# EAGLE design main_backupboard (EAGLE 9.6.2)

## Sheet 1 of 2
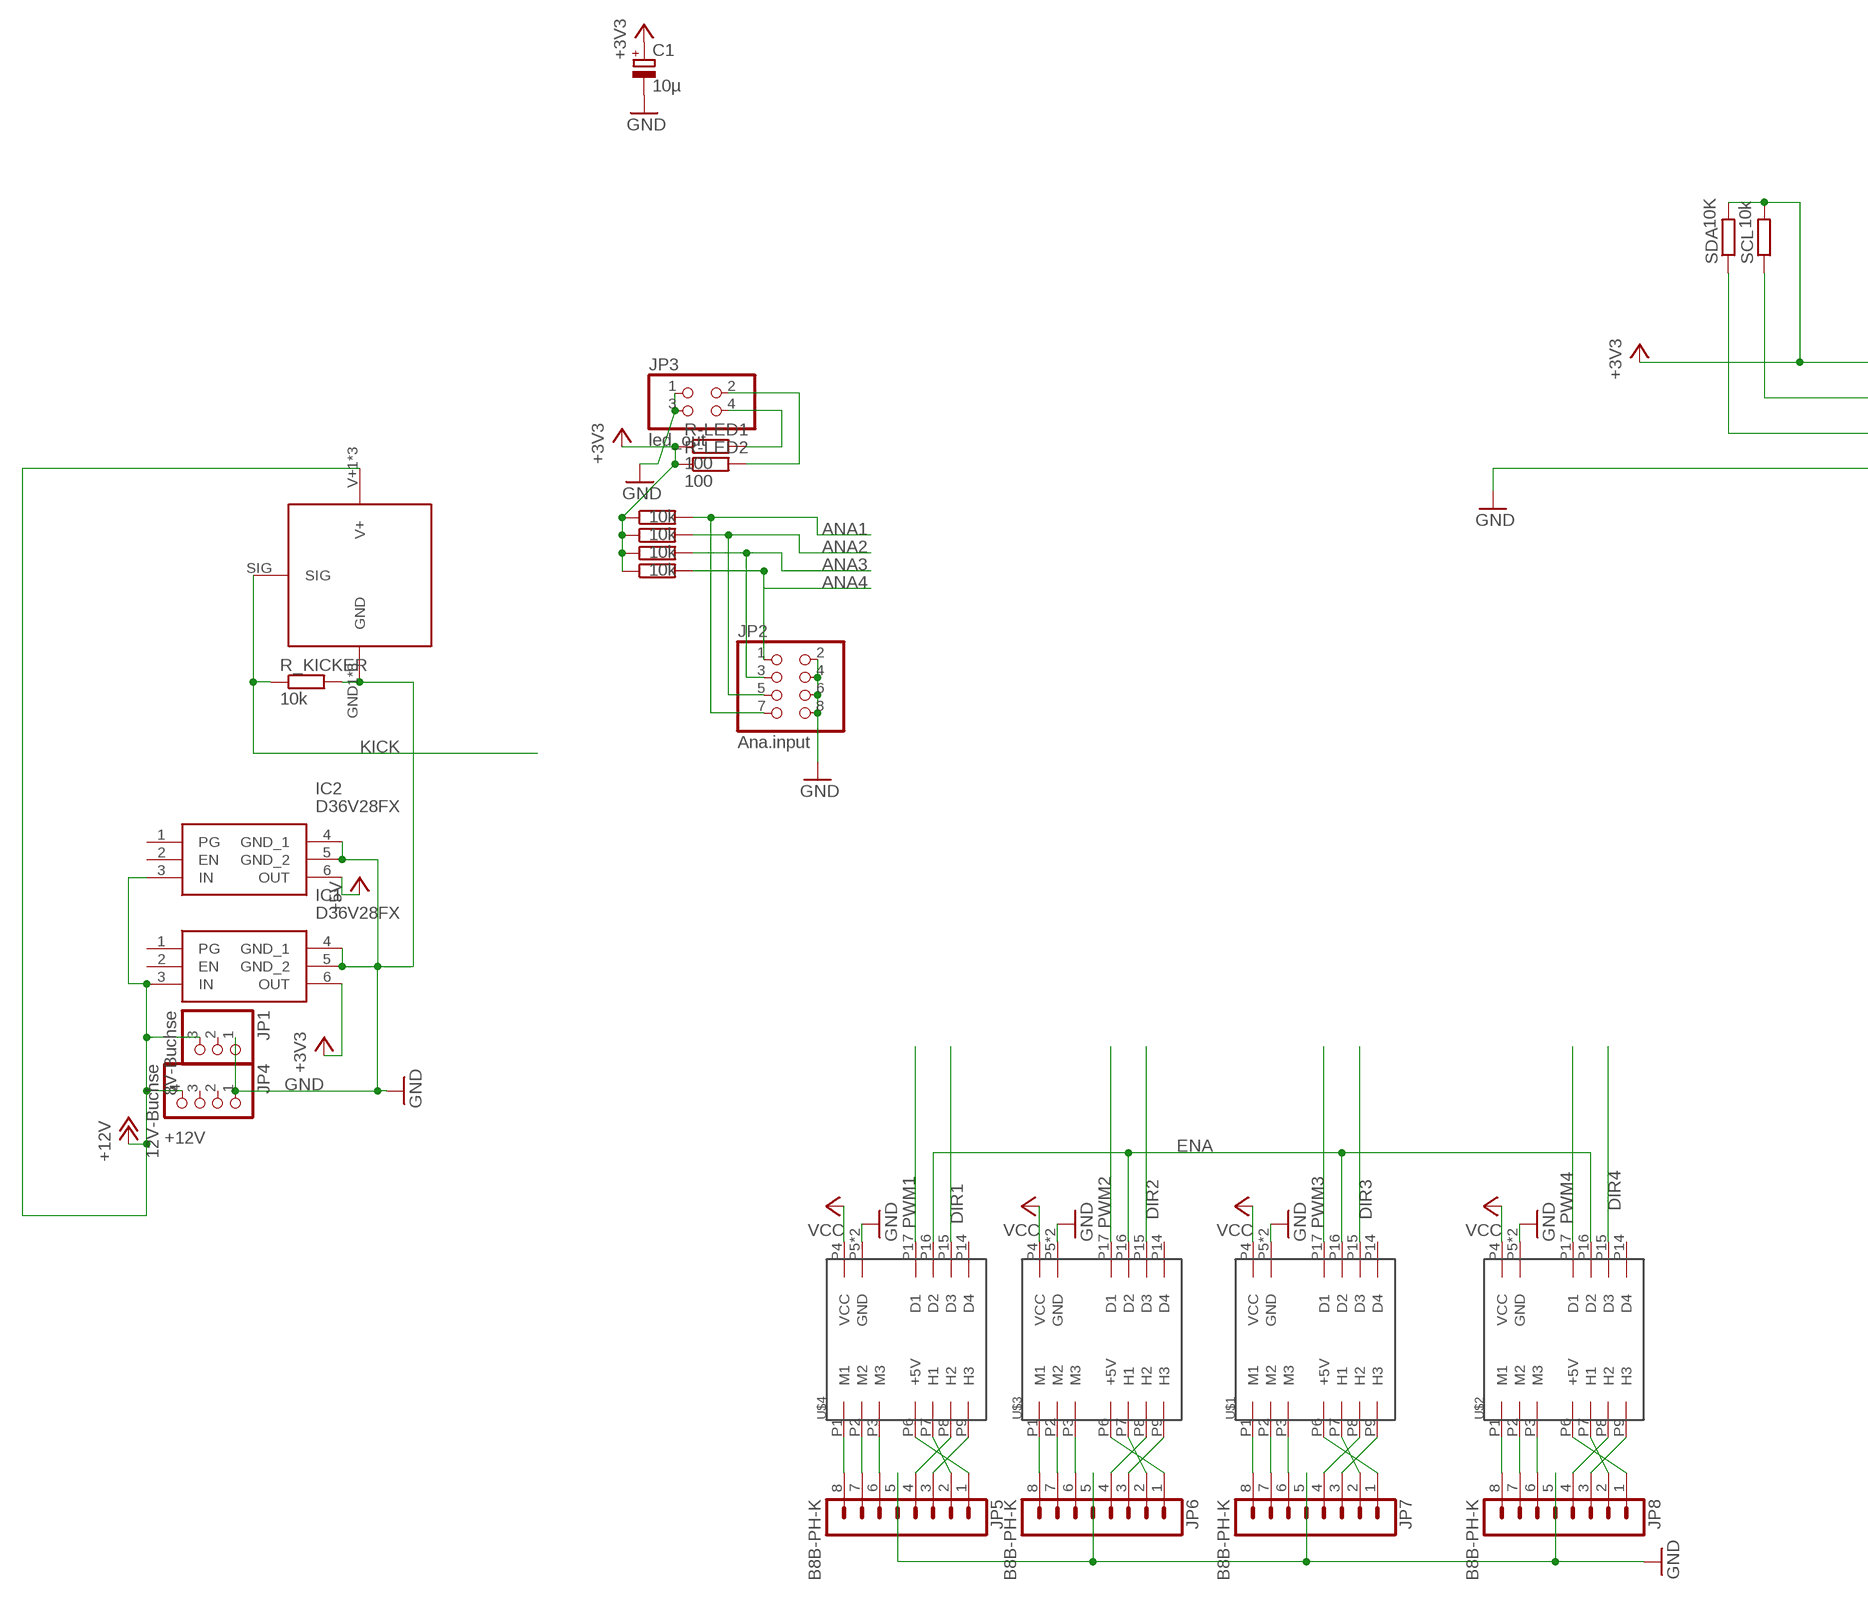
[diagram p0: schematic, sheet 1, part 1 of 2]
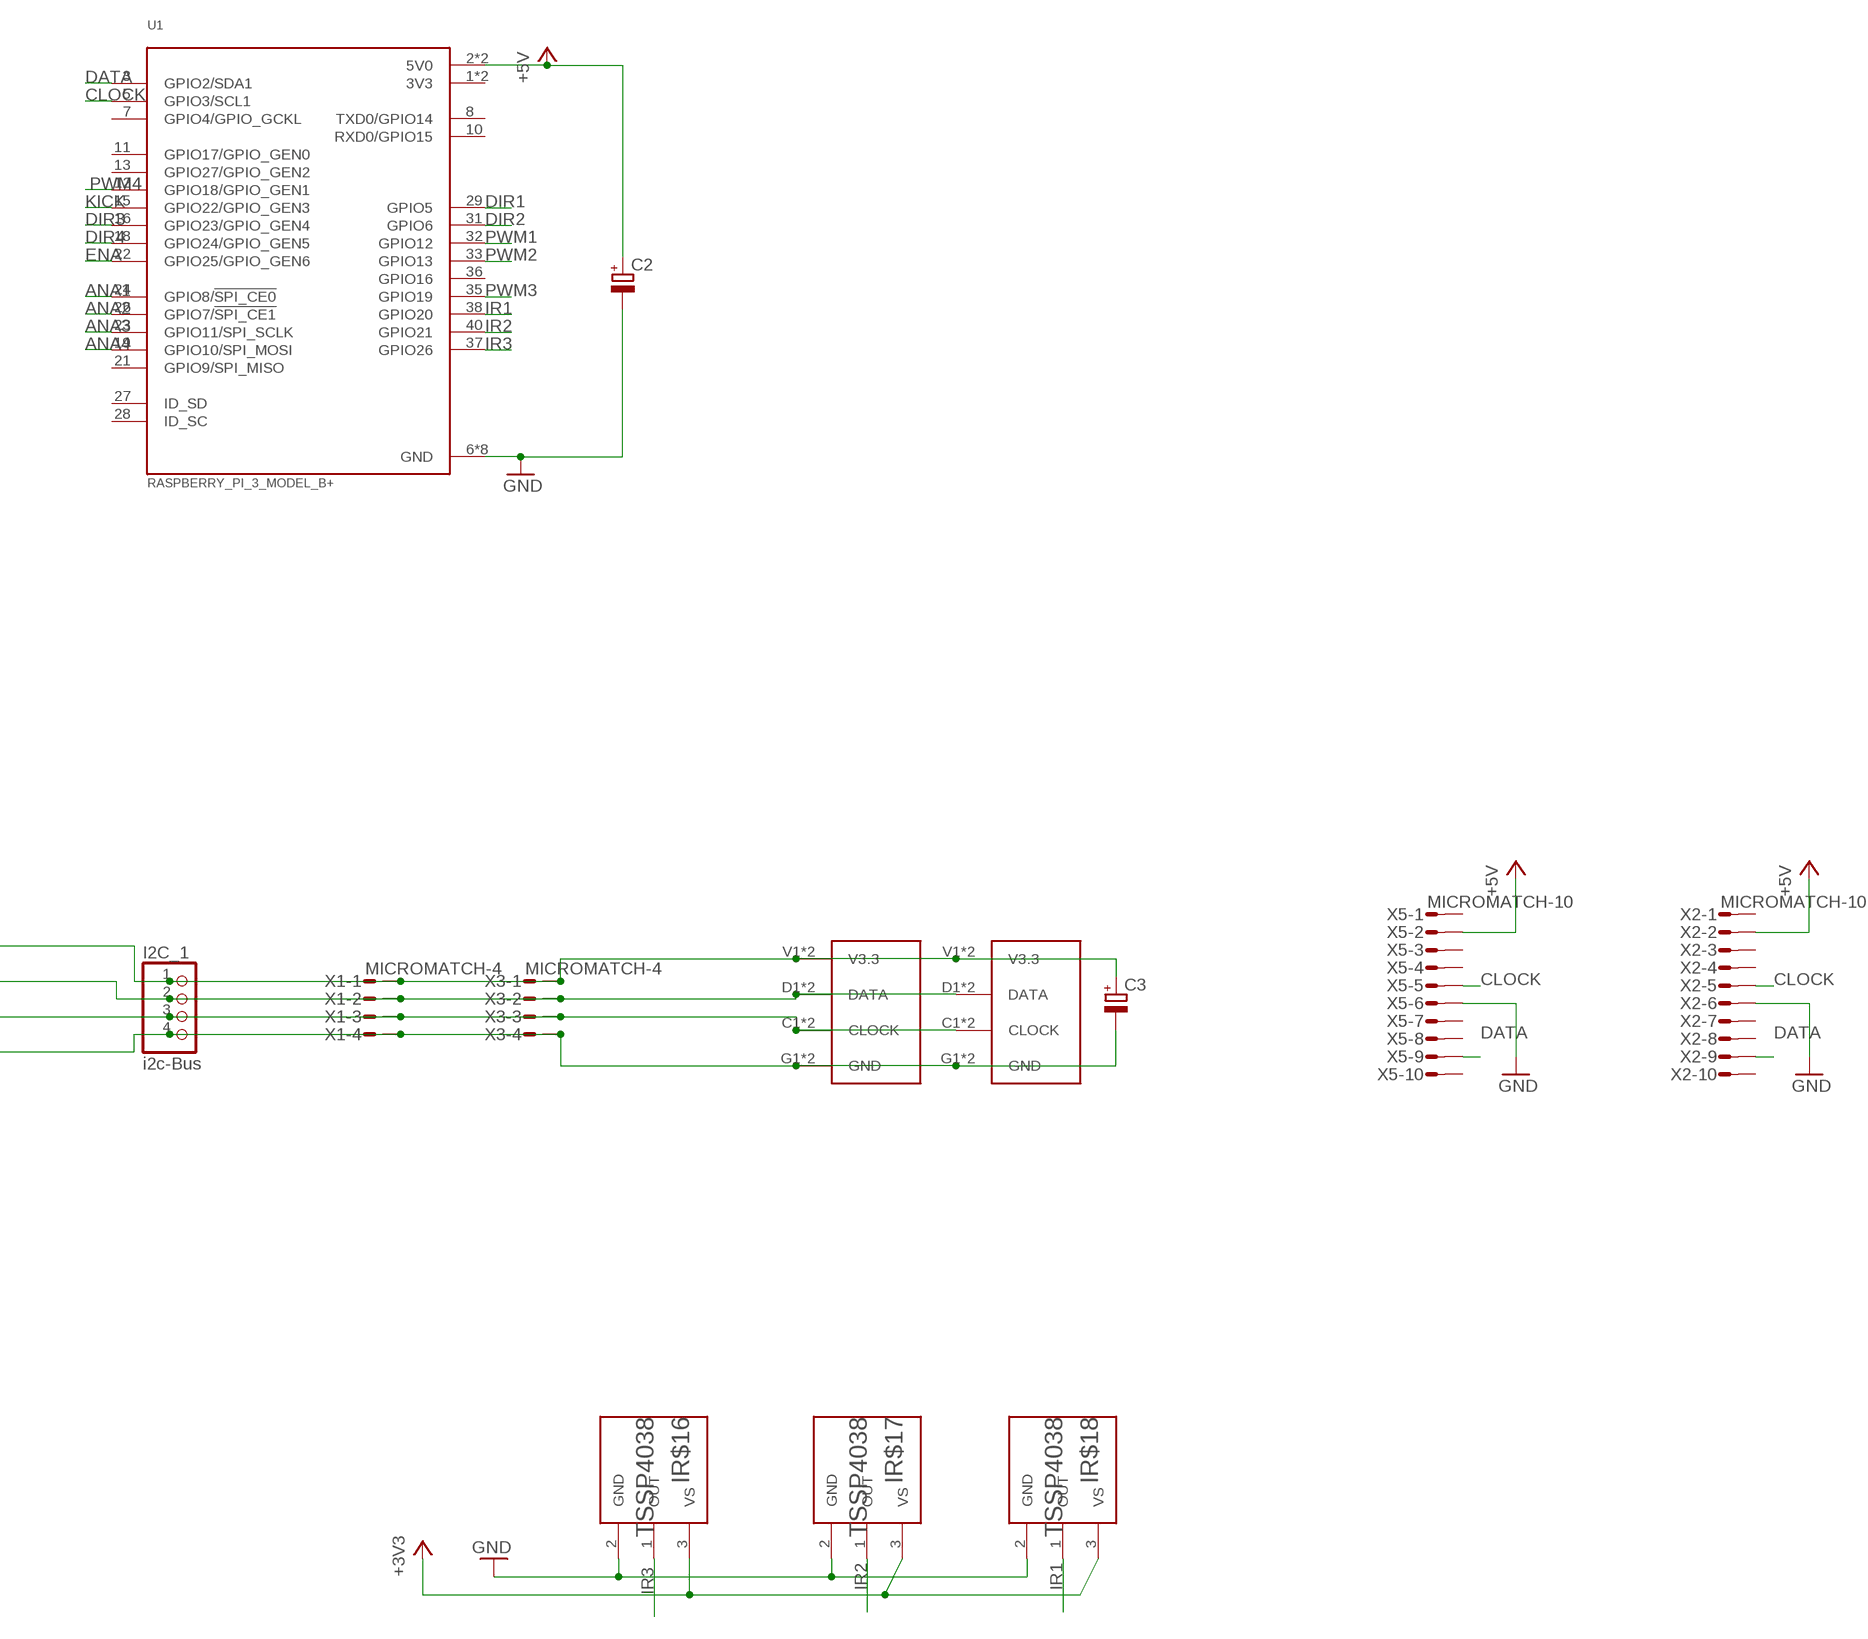
[diagram p1: schematic, sheet 1, part 2 of 2]

### Parts
C1  10µ  CPOL-EUE2,5-6E  [E2,5-6E]
C2  CPOL-EUE2-5  [E2-5]
C3  CPOL-EUE2-5  [E2-5]
I2C_1  i2c-Bus  PINHD-1X4  [1X04]
IC1  D36V28FX  [D36V28FX]
IC2  D36V28FX  [D36V28FX]
IR$16  TSSP4038  [XDCR_TSSP4038]
IR$17  TSSP4038  [XDCR_TSSP4038]
IR$18  TSSP4038  [XDCR_TSSP4038]
JP1  8V-Buchse  PINHD-1X3  [1X03]
JP2  Ana.input  PINHD-2X4  [2X04]
JP3  led_out  PINHD-2X2  [2X02]
JP4  12V-Buchse  PINHD-1X4  [1X04]
JP5  B8B-PH-K  [B8B-PH-K]
JP6  B8B-PH-K  [B8B-PH-K]
JP7  B8B-PH-K  [B8B-PH-K]
JP8  B8B-PH-K  [B8B-PH-K]
R-LED1  100  R-EU_0207/10  [0207/10]
R-LED2  100  R-EU_0207/10  [0207/10]
R_AD14  10k  R-EU_0207/10  [0207/10]
R_AD25  10k  R-EU_0207/10  [0207/10]
R_AD26  10k  R-EU_0207/10  [0207/10]
R_AD27  10k  R-EU_0207/10  [0207/10]
R_KICKER  10k  R-EU_0207/10  [0207/10]
SCL  10k  R-EU_0207/10  [0207/10]
SDA  10K  R-EU_0207/10  [0207/10]
U1  RASPBERRY_PI_3_MODEL_B+  [MODULE_RASPBERRY_PI_3_MODEL_B+]
U$1  24/2  [24/2]
U$2  24/2  [24/2]
U$3  24/2  [24/2]
U$4  24/2  [24/2]
U$8  TASTER_LED  [TASTER_LED]
U$9  TASTER_LED  [TASTER_LED]
U$17  KICKER  [KICKER]
X1  MICROMATCH-4  [MICROMATCH-4]
X2  MICROMATCH-10  [MICROMATCH-10]
X3  MICROMATCH-4  [MICROMATCH-4]
X5  MICROMATCH-10  [MICROMATCH-10]

### Nets
+3V3: C1.+ C3.+ I2C_1.1 IC1.6(OUT) IR$16.3(VS) IR$17.3(VS) IR$18.3(VS) R-LED1.1 R-LED2.1 R_AD14.1 R_AD25.1 R_AD26.1 R_AD27.1 SCL.2 SDA.2 U$8.V1(V3.3) U$8.V2(V3.3) U$9.V1(V3.3) U$9.V2(V3.3) X1.1 X3.1
+5V: C2.+ IC2.6(OUT) U1.2(5V0) U1.4(5V0) X2.2 X5.2
+12V: IC1.3(IN) IC2.3(IN) JP1.3 JP4.4 U$1.P4(VCC) U$2.P4(VCC) U$3.P4(VCC) U$4.P4(VCC) U$17.V+1(V+) U$17.V+2(V+) U$17.V+3(V+) ; supply symbol labelled VCC
ANA1: JP2.7 R_AD25.2 U1.24(GPIO8/!SPI_CE0!)
ANA2: JP2.5 R_AD26.2 U1.26(GPIO7/!SPI_CE1!)
ANA3: JP2.3 R_AD27.2 U1.23(GPIO11/SPI_SCLK)
ANA4: JP2.1 R_AD14.2 U1.19(GPIO10/SPI_MOSI)
CLOCK: I2C_1.3 SDA.1 U1.5(GPIO3/SCL1) U$8.C1(CLOCK) U$8.C2(CLOCK) U$9.C1(CLOCK) U$9.C2(CLOCK) X1.3 X2.5 X3.3 X5.5
DATA: I2C_1.2 SCL.1 U1.3(GPIO2/SDA1) U$8.D1(DATA) U$8.D2(DATA) U$9.D1(DATA) U$9.D2(DATA) X1.2 X2.9 X3.2 X5.9
DIR1: U1.29(GPIO5) U$4.P15(D3)
DIR2: U1.31(GPIO6) U$3.P15(D3)
DIR3: U1.16(GPIO23/GPIO_GEN4) U$1.P15(D3)
DIR4: U1.18(GPIO24/GPIO_GEN5) U$2.P15(D3)
ENA: U1.22(GPIO25/GPIO_GEN6) U$1.P16(D2) U$2.P16(D2) U$3.P16(D2) U$4.P16(D2)
GND: C1.- C2.- C3.- I2C_1.4 IC1.4(GND_1) IC1.5(GND_2) IC2.4(GND_1) IC2.5(GND_2) IR$16.2(GND) IR$17.2(GND) IR$18.2(GND) JP1.1 JP2.2 JP2.4 JP2.6 JP2.8 JP3.1 JP3.3 JP4.1 JP5.5 JP6.5 JP7.5 JP8.5 R_KICKER.2 U1.6(GND) U1.9(GND) U1.14(GND) U1.20(GND) U1.25(GND) U1.30(GND) U1.34(GND) U1.39(GND) U$1.P5(GND) U$1.P18(GND) U$2.P5(GND) U$2.P18(GND) U$3.P5(GND) U$3.P18(GND) U$4.P5(GND) U$4.P18(GND) U$8.G1(GND) U$8.G2(GND) U$9.G1(GND) U$9.G2(GND) U$17.GND1(GND) U$17.GND2(GND) U$17.GND3(GND) U$17.GND4(GND) U$17.GND5(GND) U$17.GND6(GND) U$17.GND7(GND) U$17.GND8(GND) X1.4 X2.6 X3.4 X5.6
IR1: IR$18.1(OUT) U1.38(GPIO20)
IR2: IR$17.1(OUT) U1.40(GPIO21)
IR3: IR$16.1(OUT) U1.37(GPIO26)
KICK: R_KICKER.1 U1.15(GPIO22/GPIO_GEN3) U$17.SIG
N$6: JP5.8 U$4.P1(M1)
N$7: JP5.7 U$4.P2(M2)
N$8: JP3.4 R-LED1.2
N$9: JP3.2 R-LED2.2
N$10: JP5.6 U$4.P3(M3)
N$11: JP6.8 U$3.P1(M1)
N$12: JP6.7 U$3.P2(M2)
N$13: JP6.6 U$3.P3(M3)
N$14: JP7.8 U$1.P1(M1)
N$15: JP7.7 U$1.P2(M2)
N$16: JP7.6 U$1.P3(M3)
N$17: JP8.8 U$2.P1(M1)
N$18: JP8.7 U$2.P2(M2)
N$19: JP8.6 U$2.P3(M3)
N$20: JP5.1 U$4.P6(+5V)
N$21: JP6.1 U$3.P6(+5V)
N$22: JP7.1 U$1.P6(+5V)
N$23: JP8.1 U$2.P6(+5V)
N$24: JP5.2 U$4.P7(H1)
N$25: JP5.3 U$4.P9(H3)
N$26: JP5.4 U$4.P8(H2)
N$27: JP6.2 U$3.P7(H1)
N$28: JP6.3 U$3.P9(H3)
N$29: JP6.4 U$3.P8(H2)
N$30: JP7.2 U$1.P7(H1)
N$31: JP7.3 U$1.P9(H3)
N$32: JP7.4 U$1.P8(H2)
N$33: JP8.2 U$2.P7(H1)
N$34: JP8.3 U$2.P9(H3)
N$35: JP8.4 U$2.P8(H2)
PWM1: U1.32(GPIO12) U$4.P17(D1)
PWM2: U1.33(GPIO13) U$3.P17(D1)
PWM3: U1.35(GPIO19) U$1.P17(D1)
PWM4: U1.12(GPIO18/GPIO_GEN1) U$2.P17(D1)
Unconnected: IC1.1(PG) IC1.2(EN) IC2.1(PG) IC2.2(EN) JP1.2 JP4.2 JP4.3 U1.7(GPIO4/GPIO_GCKL) U1.8(TXD0/GPIO14) U1.10(RXD0/GPIO15) U1.11(GPIO17/GPIO_GEN0) U1.13(GPIO27/GPIO_GEN2) U1.21(GPIO9/SPI_MISO) U1.27(ID_SD) U1.28(ID_SC) U1.36(GPIO16) U$1.P14(D4) U$2.P14(D4) U$3.P14(D4) U$4.P14(D4) X2.1 X2.3 X2.4 X2.7 X2.8 X2.10 X5.1 X5.3 X5.4 X5.7 X5.8 X5.10

## Sheet 2 of 2

## Power pins joined to a net without a drawn wire
3V3: U1.1(3V3) U1.17(3V3)

## Library data of the parts
C1-C3 = rcl:CPOL-EU: POLARIZED CAPACITOR, European symbol; SPICEPREFIX: C
I2C_1 JP4 = pinhead:PINHD-1X4: PIN HEADER
IC1 IC2 = D36V28FX:D36V28FX: 5V, 3.2A Step-Down Voltage Regulator D36V28F5 Source: Datasheet <https://www.pololu.com/product/3782>; DESCRIPTION: 5V, 3.2A Step-Down Voltage Regulator D36V28F5; HEIGHT: 8.77mm; MANUFACTURER_NAME: POLOLU ROBOTICS & ELECTRONICS; MANUFACTURER_PART_NUMBER: D36V28FX
IR$16-IR$18 = TSSP4038:TSSP4038: Check availability <https://pricing.snapeda.com/parts/TSSP4038/Vishay%20Semiconductor/view-part?ref=eda>; AVAILABILITY: In Stock; DESCRIPTION: Remote Receiver Sensor, 38.0kHz 1m PCB, Through Hole; MF: Vishay Semiconductor; MP: TSSP4038; PACKAGE: None; PRICE: None; PURCHASE-URL: https://pricing.snapeda.com/search/part/TSSP4038/?ref=eda
JP1 = pinhead:PINHD-1X3: PIN HEADER
JP2 = pinhead:PINHD-2X4: PIN HEADER
JP3 = pinhead:PINHD-2X2: PIN HEADER
JP5-JP8 = con-jst-ph:B8B-PH-K: HEADER
R-LED1 R-LED2 R_AD14 R_AD25-R_AD27 R_KICKER SCL SDA = rcl:R-EU_: RESISTOR, European symbol; SPICEPREFIX: R
U1 = RASPBERRY_PI_3_MODEL_B_:RASPBERRY_PI_3_MODEL_B+: BCM2835 Raspberry Pi Model B+ - ARM11, VideoCore MPU Embedded Evaluation Board Check availability <https://pricing.snapeda.com/parts/RASPBERRY%20PI%203%20MODEL%20B%2B/Raspberry%20Pi/view-part?ref=eda>; AVAILABILITY: In Stock; DESCRIPTION: RASPBERRY PI 3 MOD B+ BCM2837B0; MF: Raspberry Pi; MP: RASPBERRY PI 3 MODEL B+; PACKAGE: None; PRICE: None; PURCHASE-URL: https://pricing.snapeda.com/search/part/RASPBERRY PI 3 MODEL B+/?ref=eda
U$1-U$4 = maxon-Regler:24/2
U$8 U$9 = Taster_LED:TASTER_LED: Taster / LED Board mit 2 Tastern und 2 LEDs Angeschlossen über i2c Port Expander PCF8574TS i2c Adresse zwingend per Lötbrücke zu setzen.
U$17 = kicker:KICKER
X1 X3 = con-amp-micromatch:MICROMATCH-4: MicroMaTch 4 7-215464-4 / 0-215464-4 Drawing Number C-215464 DDEController.pdf; MPN: 7-215464-4; OC_FARNELL: 3784629; OC_NEWARK: 19R8124
X2 X5 = con-amp-micromatch:MICROMATCH-10: MicroMaTch 10 8-215464-0 / 1-215464-0 Drawing Number C-215464 DDEController.pdf; MF: FARNELL; MPN: 8-215464-0; OC_FARNELL: 3784654; OC_NEWARK: 19J6430

## Board
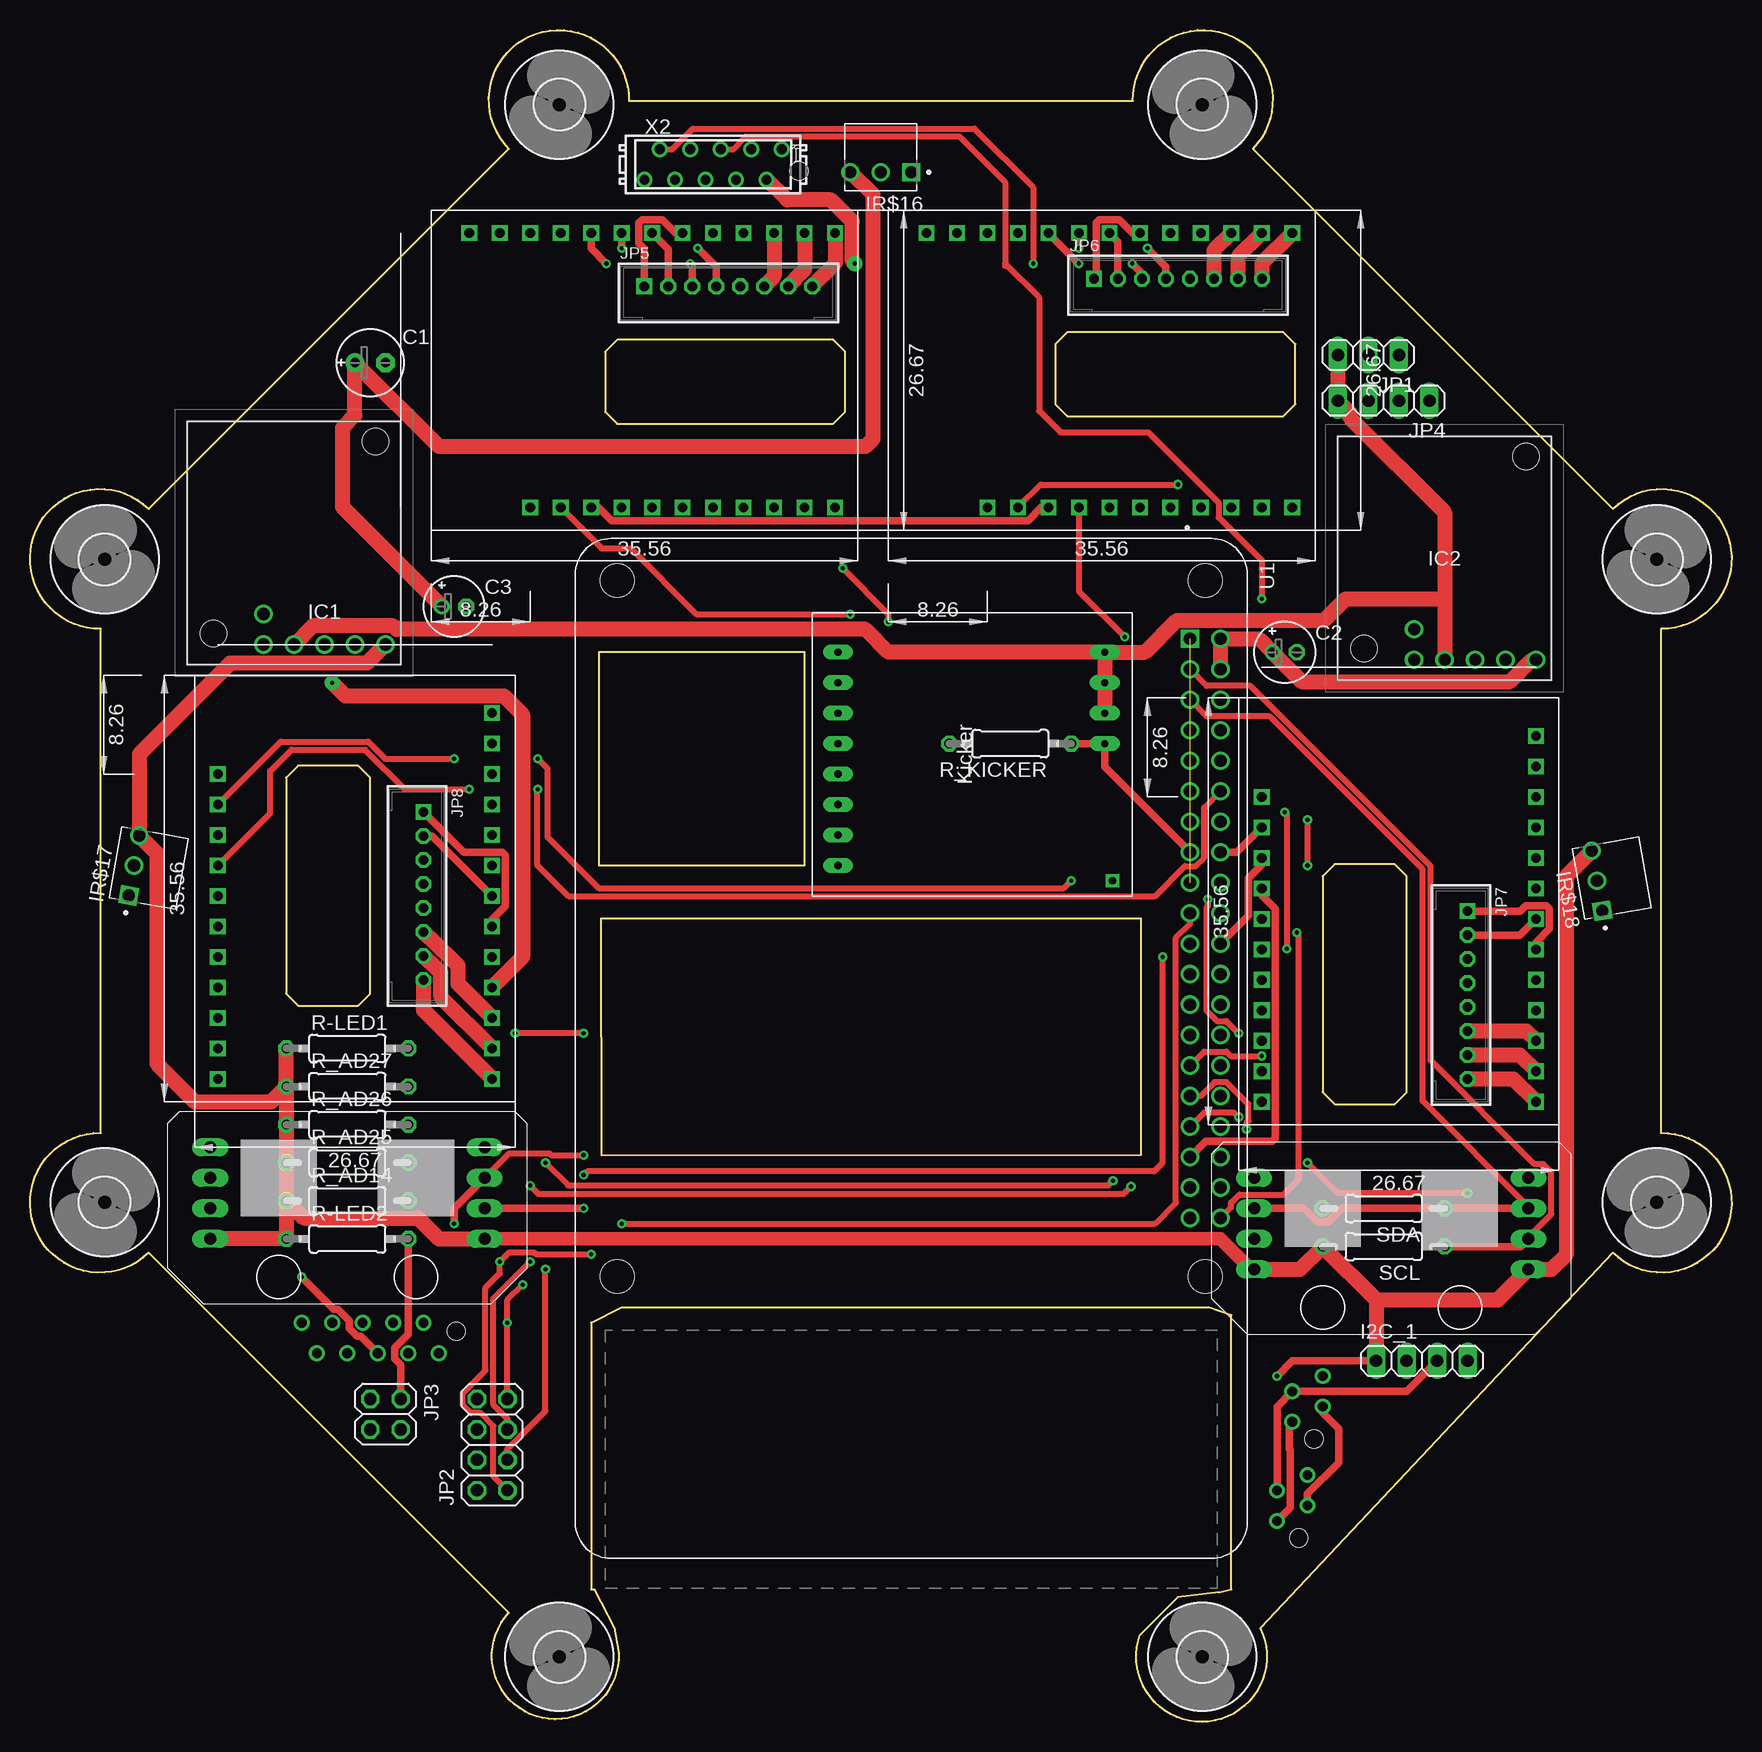
[diagram p2: board, top side]
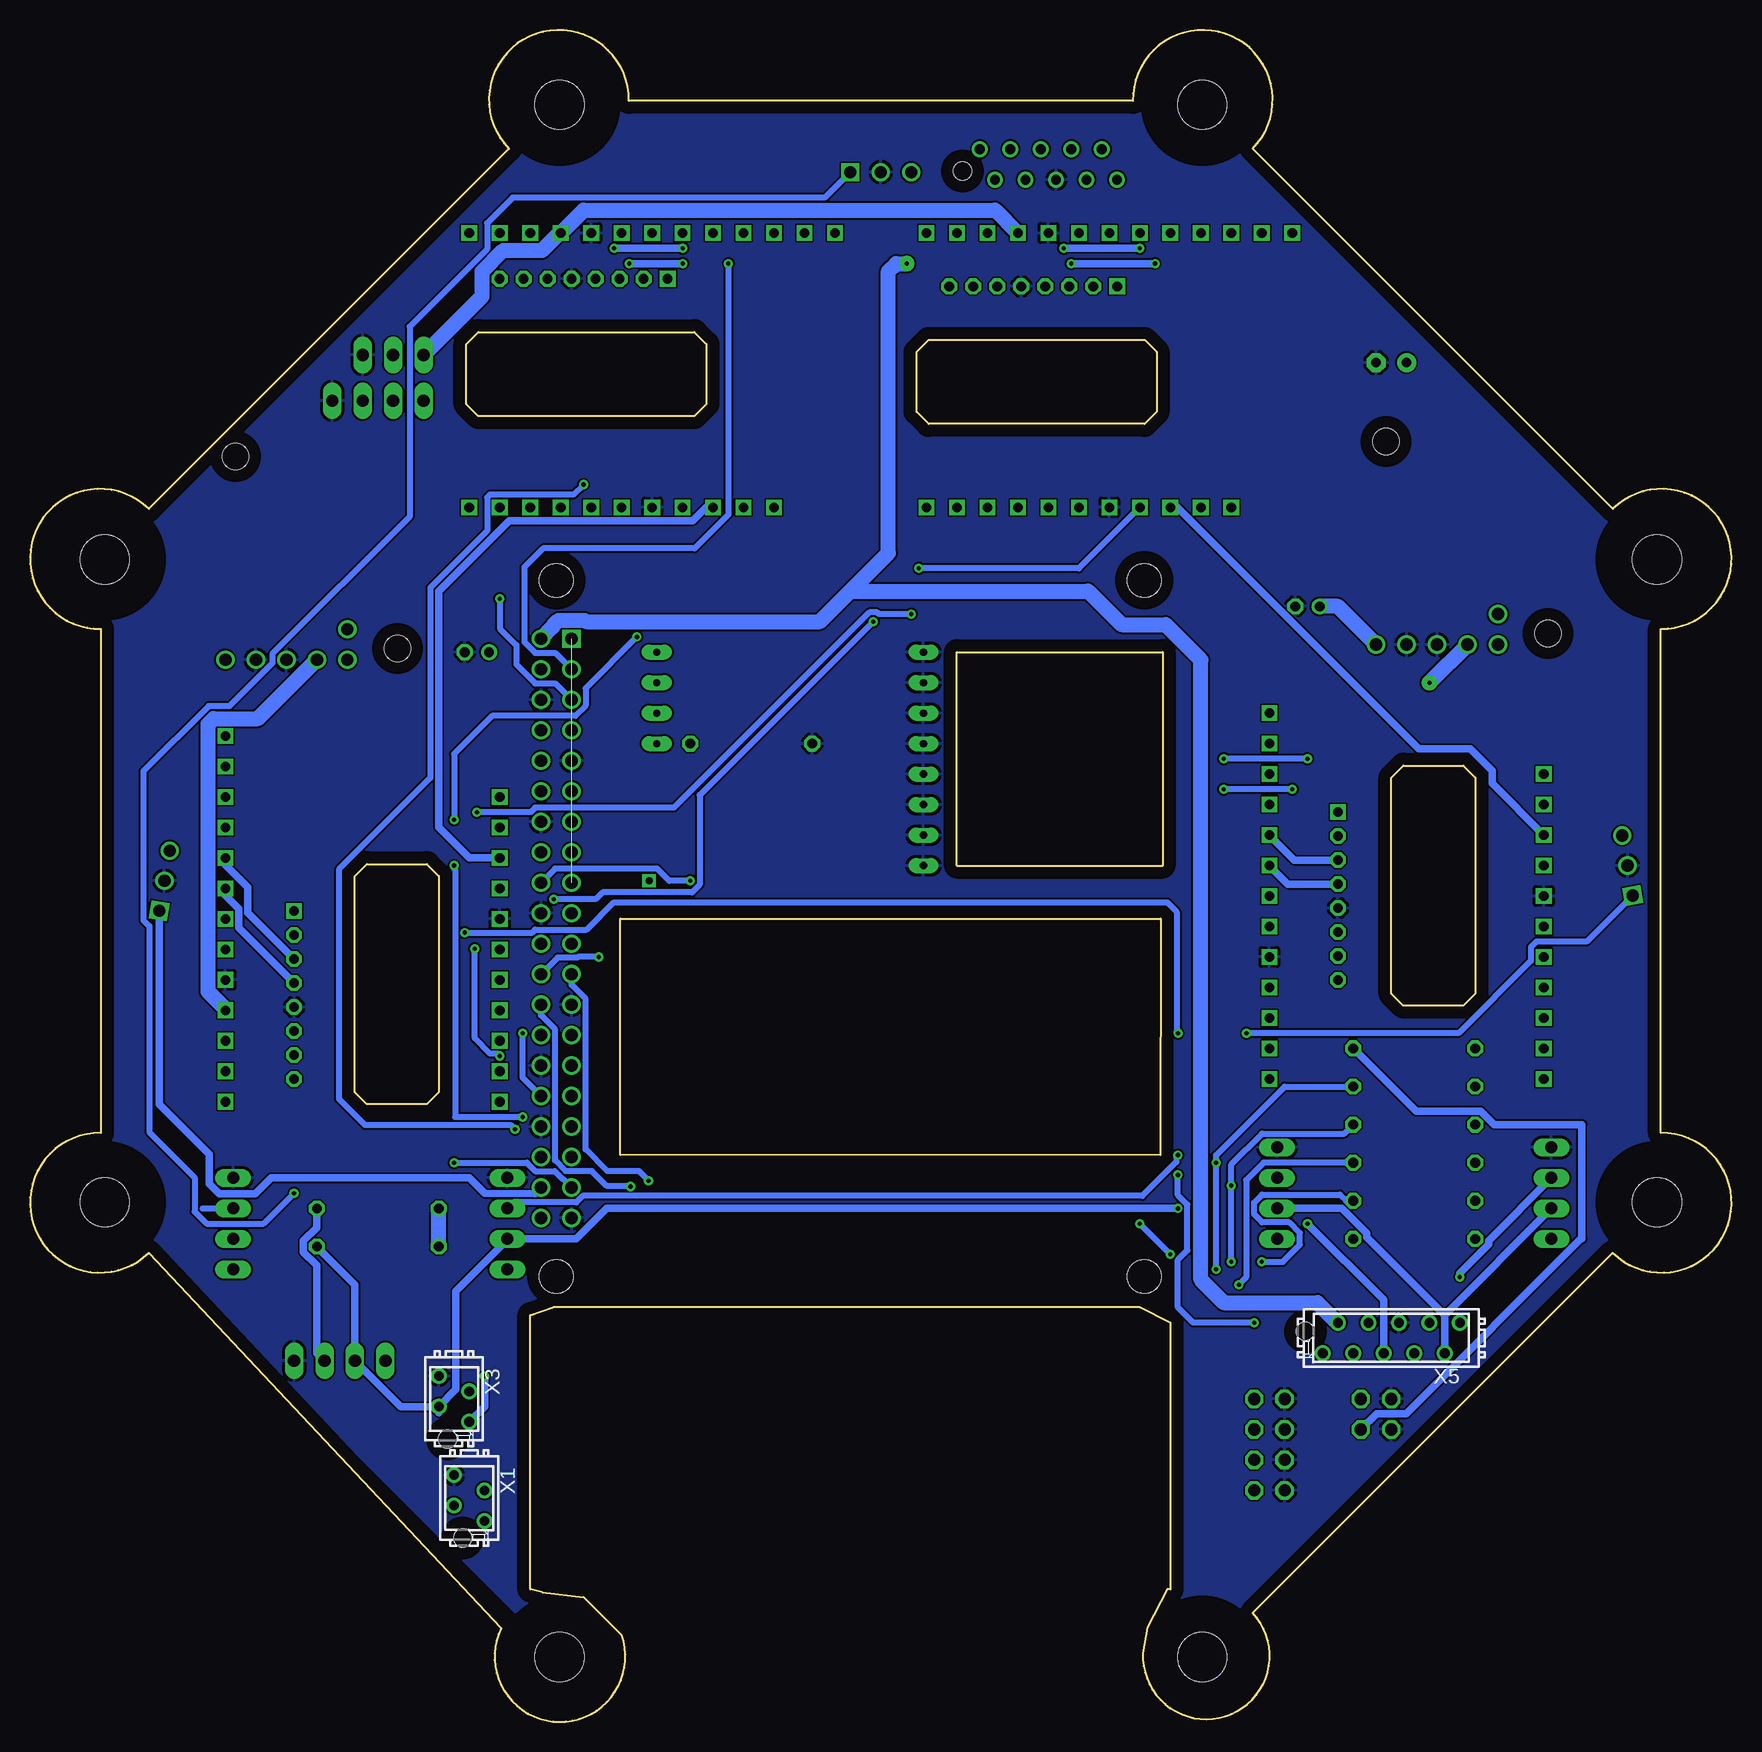
[diagram p3: board, bottom side, seen from below]

Size 141.8 x 140.99 mm. Coordinates in mm from the lower left corner, seen from the top.
Outline: 5.9,49.09 5.9,91.09 arc-225 9.9,101.09 39.9,131.09 arc-225 49.9,135.09 91.9,135.09 arc-225 101.9,131.09 131.9,101.09 arc-225 135.9,91.09 135.9,49.09 arc-225 131.9,39.09 102.53,7.82 arc-225 92.49,7.23 95.66,10.4 99.09,10.78 100.11,11.04 100.11,33.9 98.2,34.53 49.31,34.53 46.77,33.26 46.77,11.04 47.02,11.04 48.67,7.86 49.05,5.7 arc-225 39.9,9.09 9.9,39.09 arc-225 5.9,49.09
Outline: 114.71,52.48 114.71,70.48 113.71,71.48 108.71,71.48 107.71,70.48 107.71,52.48 108.71,51.48 113.71,51.48 114.71,52.48
Outline: 86.44,108.81 104.44,108.81 105.44,109.81 105.44,114.81 104.44,115.81 86.44,115.81 85.44,114.81 85.44,109.81 86.44,108.81
Outline: 28.35,60.68 28.35,78.68 27.35,79.68 22.35,79.68 21.35,78.68 21.35,60.68 22.35,59.68 27.35,59.68 28.35,60.68
Outline: 48.92,108.18 66.92,108.18 67.92,109.18 67.92,114.18 66.92,115.18 48.92,115.18 47.92,114.18 47.92,109.18 48.92,108.18
Outline: 92.59,47.26 92.59,66.94 47.58,66.94 47.61,47.23 92.59,47.26
Outline: 64.55,71.36 64.55,89.14 47.4,89.14 47.4,71.36 64.55,71.36
Copper layers (1*16): Top 0.035mm / dielectric 1.5mm / Bottom 0.035mm
Design rules "default": minimum track width 6mil, minimum drill 0.35mm, track to track 6mil, track to pad 6mil, pad to pad 6mil, via to via 6mil, smd to smd 6mil, copper to edge 40mil, drill to drill 6mil, minimum pad ring 10mil, minimum via ring 8mil, stop-mask expansion 4mil, vias tented up to drill 0mil, thermal gap 10mil

### Footprints (pad centres in the part's own frame; a part is rotated, then mirrored left to right if it is on the bottom)
E2,5-6E = drill 0.813 pad 1.575: + -1.27,0 | drill 0.813 pad 1.575 octagon: - 1.27,0
E2-5 = drill 0.813 pad 1.27: + -1.016,0 | drill 0.813 pad 1.27 octagon: - 1.016,0
1X04 = drill 1.016 long: 1 -3.81,0; 2 -1.27,0; 3 1.27,0; 4 3.81,0
D36V28FX = drill 1.02 pad 1.53: 1 0,0; 2 0,-2.54; 3 2.54,-2.54; 4 5.08,-2.54; 5 7.62,-2.54; 6 10.16,-2.54 | hole 2.18: -4.17,-1.61; 9.33,14.39
XDCR_TSSP4038 = drill 1.01 square: 1 -2.54,0 | drill 1.01: 2 0,0; 3 2.54,0
1X03 = drill 1.016 long: 1 -2.54,0; 2 0,0; 3 2.54,0
2X04 = drill 1.016 octagon: 1 -3.81,-1.27; 2 -3.81,1.27; 3 -1.27,-1.27; 4 -1.27,1.27; 5 1.27,-1.27; 6 1.27,1.27; 7 3.81,-1.27; 8 3.81,1.27
2X02 = drill 1.016 octagon: 1 -1.27,-1.27; 2 -1.27,1.27; 3 1.27,-1.27; 4 1.27,1.27
B8B-PH-K = drill 0.813 square: 1 -7,0 | drill 0.813 octagon: 2 -5,0; 3 -3,0; 4 -1,0; 5 1,0; 6 3,0; 7 5,0; 8 7,0
0207/10 = drill 0.813 octagon: 1 -5.08,0; 2 5.08,0
MODULE_RASPBERRY_PI_3_MODEL_B+ = drill 1.016 square: 1 -34.13,23.23 | drill 1.016: 2 -34.13,25.77; 3 -31.59,23.23; 4 -31.59,25.77; 5 -29.05,23.23; 6 -29.05,25.77; 7 -26.51,23.23; 8 -26.51,25.77; 9 -23.97,23.23; 10 -23.97,25.77; 11 -21.43,23.23; 12 -21.43,25.77; 13 -18.89,23.23; 14 -18.89,25.77; 15 -16.35,23.23; 16 -16.35,25.77; 17 -13.81,23.23; 18 -13.81,25.77; 19 -11.27,23.23; 20 -11.27,25.77; 21 -8.73,23.23; 22 -8.73,25.77; 23 -6.19,23.23; 24 -6.19,25.77; 25 -3.65,23.23; 26 -3.65,25.77; 27 -1.11,23.23; 28 -1.11,25.77; 29 1.43,23.23; 30 1.43,25.77; 31 3.97,23.23; 32 3.97,25.77; 33 6.51,23.23; 34 6.51,25.77; 35 9.05,23.23; 36 9.05,25.77; 37 11.59,23.23; 38 11.59,25.77; 39 14.13,23.23; 40 14.13,25.77 | hole 2.8: -39,-24.5; 19,24.5; -39,24.5; 19,-24.5
24/2 = drill 0.8 square: P1 15.875,10.795; P2 13.335,10.795; P3 10.795,10.795; P4 8.255,10.795; P5 5.715,10.795; P6 3.175,10.795; P7 0.635,10.795; P8 -1.905,10.795; P9 -4.445,10.795; P10 -6.985,10.795; P11 -9.525,10.795; P12 -12.065,10.795; P13 -14.605,10.795; P14 -9.525,-12.065; P15 -6.985,-12.065; P16 -4.445,-12.065; P17 -1.905,-12.065; P18 0.635,-12.065; P19 3.175,-12.065; P20 5.715,-12.065; P21 8.255,-12.065; P22 10.795,-12.065; P23 13.335,-12.065; P24 15.875,-12.065
4,1 = hole 4.1: 0,0
TASTER_LED = drill 1 long: C1 -11.43,-4.445; C2 11.43,-4.445; D1 -11.43,-1.905; D2 11.43,-1.905; G1 -11.43,-6.985; G2 11.43,-6.985; V1 -11.43,0.635; V2 11.43,0.635
KICKER = drill 0.6 pad 1.27 long: GND1 2.54,24.511; GND2 5.08,24.511; GND3 7.62,24.511; GND4 10.16,24.511; GND5 12.7,24.511; GND6 15.24,24.511; GND7 17.78,24.511; GND8 20.32,24.511; SIG 12.7,2.286; V+1 15.24,2.286; V+2 17.78,2.286; V+3 20.32,2.286 | drill 0.6 square: NC 1.27,1.651
MICROMATCH-4 = drill 0.8: 1 1.905,1.27; 2 0.635,-1.27; 3 -0.635,1.27; 4 -1.905,-1.27 | hole 1.5: 3.34,-0.55
MICROMATCH-10 = drill 0.813: 1 5.715,1.27; 2 4.445,-1.27; 3 3.175,1.27; 4 1.905,-1.27; 5 0.635,1.27; 6 -0.635,-1.27; 7 -1.905,1.27; 8 -3.175,-1.27; 9 -4.445,1.27; 10 -5.715,-1.27 | hole 1.5: 7.16,-0.55

### Placement (x,y rotation side)
C1  28.35,113.27 0 top
C2  104.55,89.14 0 top
C3  35.34,92.95 0 top
I2C_1  115.98,30.09 0 top
IC1  19.46,92.32 0 top
IC2  115.35,91.05 0 top
IR$16  70.9,129.15 180 top
IR$17  8.67,71.36 80 top
IR$18  130.59,70.09 100 top
JP1  111.54,113.91 180 top
JP2  38.51,23.1 90 top
JP3  29.62,25.64 270 top
JP4  112.81,110.1 180 top
JP5  58.2,119.62 0 top
JP6  95.66,120.26 0 top
JP7  119.79,60.57 270 top
JP8  32.8,68.82 270 top
R-LED1  26.45,56.12 0 top
R-LED2  26.45,40.25 0 top
R_AD14  26.45,43.42 0 top
R_AD25  26.45,46.6 0 top
R_AD26  26.45,49.77 0 top
R_AD27  26.45,52.95 0 top
R_KICKER  81.69,81.52 180 top
SCL  112.81,39.61 180 top
SDA  112.81,42.79 180 top
U1  73.44,56.12 270 top
U$1  114.71,67.55 270 top
U$2  27.72,69.46 270 top
U$3  89.31,113.27 0 top
U$4  51.21,113.27 0 top
U$5  [4,1]  6.23,96.88 67.5 top
U$6  [4,1]  97.69,134.77 67.5 top
U$7  [4,1]  135.57,43.31 67.5 top
U$8  26.45,40.88 180 top
U$9  113.44,38.34 180 top
U$10  [4,1]  44.11,5.42 67.5 top
U$11  [4,1]  44.11,134.77 22.5 top
U$12  [4,1]  135.57,96.88 22.5 top
U$13  [4,1]  97.69,5.42 22.5 top
U$14  [4,1]  6.23,43.31 22.5 top
U$17  91.85,68.82 90 top
X1  105.19,18.66 270 bottom
X2  56.93,129.78 0 top
X3  106.46,26.91 270 bottom
X5  28.35,31.99 180 bottom

### Tracks (layer width: path | path; a pad name or v marks a point on that pad's centre or on a via)
3V3  (1 unrouted)
+3V3  (via drill 0.35 pad 0.61)
  Top 0.61: v103.92,28.82 105.19,30.09 I2C_1.1 | X3.1 105.19,24.68 104.94,24.43 104.94,22.72 105.03,22.62 105.03,17.86 X1.1
  Top 1.143: U$9.V2 101.71,37.71 99.17,40.25 U$8.V1
  Top 1.27: C3.+ 26.05,101.22 26.05,107.84 27.08,108.87 C1.+ 34.07,106.29 69.63,106.29 70.26,106.92 70.26,127.24 IR$16.3 | IC1.6 28.07,88.23 16.69,88.23 9.11,80.65 IR$17.3 10.57,72.4 10.57,54.85 13.75,51.68 20.1,51.68 R_AD27.1 | R_AD27.1 R_AD26.1 R_AD25.1 R_AD14.1 | R_AD14.1 R-LED2.1 U$8.V2 | R_AD27.1 R-LED1.1 | R_AD14.1 22.82,41.98 32.34,41.98 34.07,40.25 U$8.V1 | U$9.V2 105.82,37.71 SCL.2 112.17,35.17 | 112.17,35.17 I2C_1.1 | 112.17,35.17 122.33,35.17 U$9.V1 126.78,37.71 128.05,38.98 128.05,70.5 IR$18.3
  Bottom 0.61: X3.1 103.92,26.28 v103.92,28.82
  Bottom 1.27: IC1.6 32.8,92.95 C3.+ | SCL.2 SDA.2
+5V  (via drill 0.35 pad 1.27)
  Top 1.27: U1.4 U1.2 102.43,90.25 C2.+ 104.12,88.56 104.12,88.54 105.97,86.7 123.35,86.7 125.16,88.51 IC2.6 | X2.2 61.41,128.51 63.09,126.83 66.75,126.83 68.53,125.05 68.53,121.74 v68.74,121.53
  Bottom 1.27: 73.44,94.22 75.98,91.68 95.46,91.68 95.58,91.8 97.76,91.8 98.22,91.34 98.22,91.24 U1.2 | 73.44,94.22 70.26,97.4 70.26,120.89 69.63,121.53 v68.74,121.53 | 61.41,128.51 X2.2 | 73.44,94.22 53.62,94.22 50.84,91.44 47.16,91.44 44.23,88.51 44.23,36.85 42.32,34.94 34.52,34.94 32.84,33.26 X5.2
+12V  (via drill 0.35 pad 1.27)
  Top 1.27: JP1.3 JP4.4 109.99,109.11 109.99,108.69 117.89,100.8 117.89,93.59 | 117.89,93.59 IC2.3 | U$17.V+3 U$17.V+2 U$17.V+1 | IC1.3 23.55,91.33 30.27,91.33 30.55,91.05 69.63,91.05 71.53,89.14 U$17.V+3 | v25.18,86.6 26.28,85.5 39.49,85.5 41.05,83.95 41.05,63.74 U$2.P4 | U$17.V+3 92.92,89.14 95.58,91.8 107.85,91.8 109.63,93.59 117.89,93.59
  Bottom 1.27: JP1.3 104.11,118.8 104.11,120.86 102.34,122.63 99.13,122.63 97.69,124.07 U$3.P4 95.66,125.97 61.37,125.97 U$4.P4 | IC1.3 v25.18,86.6 | U$1.P4 125.51,59.42 126.95,60.86 126.95,83.14 126.49,83.6 122.8,83.6 IC2.3
ANA1  (via drill 0.35 pad 0.51, 0.35 pad 0.61)
  Top 0.508: JP2.7 v39.78,33.26 39.78,35.17 v41.05,36.44 | v46.13,45.58 46.44,45.89 93.68,45.89 94.39,46.6 v94.39,63.74
  Bottom 0.508: R_AD25.2 39,46.6 40.45,45.15 40.45,37.04 v41.05,36.44 | v39.78,33.26 44.86,33.26 46.13,34.53 46.13,38.5 45.35,39.29 45.35,43.11 46.13,43.9 v46.13,45.58 | v94.39,63.74 96.13,63.74 96.18,63.69 97.84,63.69 U1.24
ANA2  (via drill 0.35 pad 0.51, 0.35 pad 0.61)
  Top 0.508: JP2.5 39.78,25.26 38.61,26.43 38.61,35.27 v41.69,38.34 | v41.69,44.69 42.4,43.98 91.12,43.98 v91.75,44.62
  Bottom 0.508: R_AD26.2 32.27,49.03 39.11,49.03 41.69,46.45 v41.69,44.69 v41.69,38.34 | U1.26 99.21,58.89 98.04,57.72 98.04,46.79 97.15,45.91 94.97,45.91 93.76,44.69 91.83,44.69 v91.75,44.62
ANA3  (via drill 0.35 pad 0.51, 0.35 pad 0.61)
  Top 0.508: JP2.3 39.78,22.72 42.96,25.9 v42.96,37.71 | v42.96,46.6 44.84,44.72 89.87,44.72 v90.25,45.1
  Bottom 0.508: v42.96,37.71 v42.96,46.6 42.96,47.23 37.24,52.95 R_AD27.2 | U1.23 96.67,61.43 95.5,60.26 95.5,47.71 93.68,45.89 91.04,45.89 v90.25,45.1
ANA4  (via drill 0.35 pad 0.51, 0.35 pad 0.61)
  Top 0.508: JP2.1 38.61,20.46 38.61,24.65 37.52,25.75 36.76,25.75 36.07,26.43 36.07,27.4 37.95,29.28 37.95,36.18 39.15,37.37 v39.15,38.34 39.93,39.13 42.01,39.13 42.16,38.98 v46.77,38.98 | v49.31,41.52 93.76,41.52 95.5,43.26 95.5,65.34 96.67,66.51 U1.19
  Bottom 0.508: R_AD14.2 32.12,43.42 32.64,43.95 39.11,43.95 39.79,43.27 39.79,42.31 39.11,41.63 36.86,41.63 35.96,40.73 35.96,39.77 37.39,38.34 v39.15,38.34 | v46.77,38.98 v49.31,41.52
CLOCK  (via drill 0.35 pad 0.51, 0.35 pad 0.61)
  Top 0.508: v46.13,47.23 43.43,47.23 43.28,47.38 39.93,47.38 U$8.C1 | U$9.C1 124.87,42.93 116.06,51.75 116.06,71.04 103.3,83.8 98.04,83.8 U1.5 | X2.5 58.59,131.05 59.66,132.12 77.45,132.12 81.27,128.3 81.27,121.53 | 81.27,121.53 81.27,121.31 | 81.27,121.53 84.09,118.7 84.09,109.26 85.88,107.47 93.19,107.47 99.05,101.61 99.05,100.39 102.65,96.79 v102.65,93.59
  Top 0.61: U$9.C1 SDA.1 109.31,42.79 108.19,41.67 107.26,41.67 106.15,42.79 U$9.C2 | v22.64,37.07 25.33,34.38 25.64,34.38 26.6,33.42 26.6,32.8 27.25,32.15 27.57,32.15 X5.5 | v35.34,41.52 35.34,42.79 U$8.C1 | I2C_1.3 114.71,27.55 X3.3 103.92,26.28 X1.3
  Bottom 0.508: U$9.C2 101.51,43.29 96.26,43.29 95.72,43.83 49.1,43.83 46.26,46.67 46.26,47.11 v46.13,47.23 | 127.41,42.79 U$9.C1 | U1.5 98.04,86.55 99.69,86.55 101.27,88.12 101.27,89.73 102.65,91.11 v102.65,93.59
  Bottom 0.61: U$8.C2 20.25,40.1 20.25,39.79 22.64,37.4 v22.64,37.07 | SDA.1 117.89,41.19 119.01,40.08 119.01,39.15 117.89,38.03 117.89,30.72 I2C_1.3 | X5.5 28.99,35.17 v35.34,41.52
DATA  (via drill 0.35 pad 0.51, 0.35 pad 0.61)
  Top 0.508: U$9.D1 124.87,40.39 126.79,42.31 126.79,45.81 126.11,46.49 125.36,46.49 116.72,55.13 116.72,71.31 101.69,86.34 98.04,86.34 U1.3 | X2.9 53.51,131.05 55.24,132.78 78.7,132.78 83.6,127.88 v83.6,121.53
  Top 0.61: U$9.D1 124.24,39.61 SCL.1 | v46.13,42.79 U$8.D1 | X3.2 107.73,25.78 109.08,24.43 109.08,21.61 106.46,18.99 X1.2
  Bottom 0.508: v83.6,121.53 83.6,100.6 86.4,97.79 99.04,97.79 100.61,96.23 100.61,90 99.69,89.09 98.04,89.09 U1.3
  Bottom 0.61: U$8.D2 23.91,33.9 | X5.9 23.91,33.9 | 23.91,33.9 30.41,40.4 30.41,40.71 32.49,42.79 U$8.D1 | SCL.1 114.71,36.44 I2C_1.2 110.9,26.28 X3.2 | X3.2 107.73,25.78 | X3.2 106.3,27.71 106.3,35.89 102.01,40.18 U$9.D2 96.28,40.25 93.74,42.79 v46.13,42.79
DIR1  (via drill 0.35 pad 0.51)
  Top 0.508: U$4.P15 47.64,97.79 50.04,97.79 55.52,92.32 v68.36,92.32 | v102.65,55.49 100.06,55.49 99.69,55.86 97.84,55.86 U1.29 | v104.55,75.81 104.73,75.63 v104.73,64.43
  Bottom 0.508: v104.55,75.81 100.06,75.81 99.69,76.18 88.14,76.18 71.86,92.47 71.21,92.47 71.06,92.32 v68.36,92.32 | v102.65,55.49 102.86,55.7 103.47,55.7 104.73,56.96 v104.73,64.43
DIR2  (via drill 0.35 pad 0.51)
  Top 0.508: U$3.P15 84.23,103.11 v95.66,103.11 | v101.38,49.39 101.38,49.93 101.53,50.08 101.53,51.49 99.69,53.32 98.72,53.32 97.56,52.15 U1.31
  Bottom 0.508: v95.66,103.11 96.51,102.27 103.47,102.27 103.71,102.03 103.71,99.25 108.44,94.52 108.44,78.66 116.06,71.04 116.06,51.93 113.88,49.75 101.73,49.75 v101.38,49.39
DIR3
  Top 0.61: U1.16 100.58,72.47 U$1.P15
DIR4  (via drill 0.35 pad 0.51)
  Top 0.508: v35.34,80.25 29.62,80.25 28.18,81.69 20.9,81.69 U$2.P15 | v42.32,80.25 43.11,79.47 43.11,73.76 47.38,69.48 86.16,69.48 v86.77,70.09
  Bottom 0.508: v35.34,80.25 v42.32,80.25 | v86.77,70.09 88.52,70.09 89.53,71.1 98.04,71.1 U1.18
ENA
  Top 0.61: U1.22 101.54,67.18 101.54,70.3 102.65,71.41 U$1.P16 | U$3.P16 84.28,101.21 83.17,100.1 48.46,100.1 47.35,101.21 U$4.P16
  Bottom 0.61: U$1.P16 105.19,72 107.73,74.54 107.73,94.22 101.85,100.1 86.56,100.1 85.45,101.21 U$3.P16 | U$2.P16 19.96,78.21 19.96,79.26 21.77,81.08 26.06,81.08 46.19,101.21 U$4.P16
GND
  pour Bottom: 44.23,134.86 97.57,134.86 135.67,96.76 135.67,43.42 97.57,5.32 44.23,5.32 6.13,43.42 6.13,96.76
IR1
  Bottom 0.61: IR$18.1 131.03,51.48 126.84,47.29 126.84,44.83 126.01,44 123.03,44 121.7,45.33 105.19,45.33 103.92,44.06 99.74,44 U1.38
IR2  (via drill 0.35 pad 0.51)
  Top 0.508: U1.40 100.1,42.88 100.1,43.27 100.78,43.95 104.44,43.95 105.67,45.18 105.67,65.67 v105.57,65.78 | v46.12,57.39 v40.42,57.39 | v40.42,57.39
  Bottom 0.508: IR$17.1 12.08,65.01 16.27,65.01 16.71,64.57 16.71,63.42 22.74,57.39 v40.42,57.39 | v105.57,65.78 99.94,65.78 99.69,66.02 95.41,66.02 93.15,68.29 47.02,68.29 46.23,67.5 46.23,57.5 v46.12,57.39
IR3  (via drill 0.35 pad 0.51)
  Top 0.508: v119.79,44.06 109,44.06 v106.46,46.6
  Bottom 0.508: IR$16.1 75.57,127.01 101.58,127.01 103.71,124.89 103.71,122.73 110.17,116.28 110.17,100.43 121.6,88.99 121.6,88.22 125.18,84.64 126.92,84.64 132.34,79.22 132.34,66.8 131.86,66.32 131.86,49.14 128.07,45.35 128.07,42.51 127.08,41.52 122.33,41.52 v119.79,44.06 | U1.37 97.38,45.24 97.43,45.24 98.09,45.91 99.69,45.91 100.38,46.6 v106.46,46.6
KICK
  Top 0.61: R_KICKER.1 U$17.SIG 89.57,79.57 U1.15
N$6
  Top 1.27: U$4.P1 67.09,121.51 JP5.8
N$7
  Top 1.27: U$4.P2 64.55,121.02 63.75,120.22 63.75,120.18 JP5.7
N$8
  Bottom 0.61: JP3.4 29.57,25.69 27.1,25.69 12.55,40.25 12.48,40.25 12.48,49.77 19.79,49.77 20.9,50.89 26.3,50.89 R-LED1.2
N$9
  Top 0.61: JP3.2 30.89,29.78 30.41,30.26 30.41,31.19 31.53,32.3 R-LED2.2
N$10
  Top 1.27: U$4.P3 62.01,120.48 61.75,120.22 61.75,120.18 JP5.6
N$11
  Top 1.27: U$3.P1 102.66,121.54 JP6.8
N$12
  Top 1.27: U$3.P2 100.66,122.08 JP6.7
N$13
  Top 1.27: U$3.P3 98.66,122.62 JP6.6
N$14
  Top 1.27: U$1.P1 123.62,53.57 JP7.8
N$15
  Top 1.27: U$1.P2 124.16,55.57 JP7.7
N$16
  Top 1.27: U$1.P3 124.7,57.57 JP7.6
N$17
  Top 1.27: U$2.P1 32.8,59.3 JP8.8
N$18
  Top 1.27: JP8.7 33.35,63.27 33.4,63.27 34.25,62.42 34.25,60.39 U$2.P2
N$19
  Top 1.27: U$2.P3 35.67,61.51 35.67,63.01 33.41,65.27 33.35,65.27 JP8.6
N$20
  Top 0.61: U$4.P6 53.8,124.07 52.69,125.18 51,125.18 50.74,124.91 50.74,123.23 51.2,122.76 JP5.1
N$21
  Top 0.61: U$3.P6 91.9,124.07 90.79,125.18 89.1,125.18 88.84,124.91 88.84,120.43 JP6.1
N$22
  Top 0.61: U$1.P6 125.51,64.96 126.62,66.08 126.62,67.76 126.35,68.03 124.66,68.03 124.2,67.57 JP7.1
N$23
  Top 0.61: U$2.P6 38.51,66.87 39.62,67.98 39.62,72.21 39.36,72.47 36.15,72.47 JP8.1
N$24
  Top 0.61: U$4.P7 53.2,122.72 JP5.2
N$25  (via drill 0.35)
  Top 0.61: U$4.P9 46.77,122.8 v48.04,121.53 | v55.02,121.53 55.2,121.35 JP5.3
  Bottom 0.61: v48.04,121.53 v55.02,121.53
N$26  (via drill 0.35)
  Top 0.61: U$4.P8 v49.31,122.8 | v55.66,122.8 57.2,121.26 JP5.4
  Bottom 0.61: v49.31,122.8 v55.66,122.8
N$27
  Top 0.61: U$3.P7 90.66,123.35 JP6.2
N$28  (via drill 0.35)
  Top 0.61: U$3.P9 v87.41,121.53 | v91.85,121.53 92.66,120.72 JP6.3
  Bottom 0.61: v87.41,121.53 v91.85,121.53
N$29  (via drill 0.35)
  Top 0.61: U$3.P8 v87.41,122.8 | v93.12,122.8 94.66,121.26 JP6.4
  Bottom 0.61: v87.41,122.8 v93.12,122.8
N$30
  Top 0.61: U$1.P7 124.16,65.57 JP7.2
N$31
  Bottom 0.61: JP7.3 123.63,67.41 123.63,69.54 125.51,71.41 U$1.P9
N$32
  Bottom 0.61: JP7.4 124.4,66.17 124.4,67.76 125.51,68.87 U$1.P8
N$33
  Top 0.61: U$2.P7 33.51,73.82 JP8.2
N$34
  Bottom 0.61: U$2.P9 36.43,71.82 JP8.3
N$35
  Bottom 0.61: U$2.P8 36.97,69.82 JP8.4
PWM1  (via drill 0.35 pad 0.51)
  Top 0.508: v67.72,96.13 71.53,92.32 v71.53,91.68 | v98.15,68.54 98.15,67.99 98.04,67.88 98.04,59.29 98.93,58.4 99.69,58.4 100.7,57.39 v100.74,57.39
  Bottom 0.508: U$4.P17 54.39,96.13 v67.72,96.13 | v71.53,91.68 85.99,77.23 85.99,69.77 86.62,69.13 94.08,69.13 94.65,68.56 98.15,68.56 v98.15,68.54 | U1.32 100.74,53.69 v100.74,57.39
PWM2  (via drill 0.35 pad 0.51)
  Top 0.508: U$3.P17 87.41,94.22 v91.22,90.41 | v106.46,75.17 v106.46,71.36 | v100.74,50.41 100.7,50.41 100.33,50.78 97.84,50.78 U1.33
  Bottom 0.508: v91.22,90.41 95.5,86.13 95.5,84.69 96.35,83.83 103.28,83.83 106.46,80.66 v106.46,75.17 | v106.46,71.36 106.46,71.13 106.37,71.04 106.37,50.41 v100.74,50.41
PWM3
  Top 0.61: U$1.P17 102.65,68.87 103.76,67.76 103.76,48.63 103.52,48.39 97.99,48.39 U1.35
PWM4  (via drill 0.35 pad 0.51)
  Top 0.508: U$2.P17 20.01,75.72 20.01,79.24 21.79,81.03 27.91,81.03 31.23,77.71 v36.61,77.71 | v42.32,77.71 42.25,77.64 42.25,71.44 44.86,68.82 93.76,68.82 96.24,71.31 97.15,71.31 97.84,71.99 97.84,76.18 U1.12
  Bottom 0.508: v36.61,77.71 v42.32,77.71